# Altium schematic sheet pontH.SCHDOC
size A4
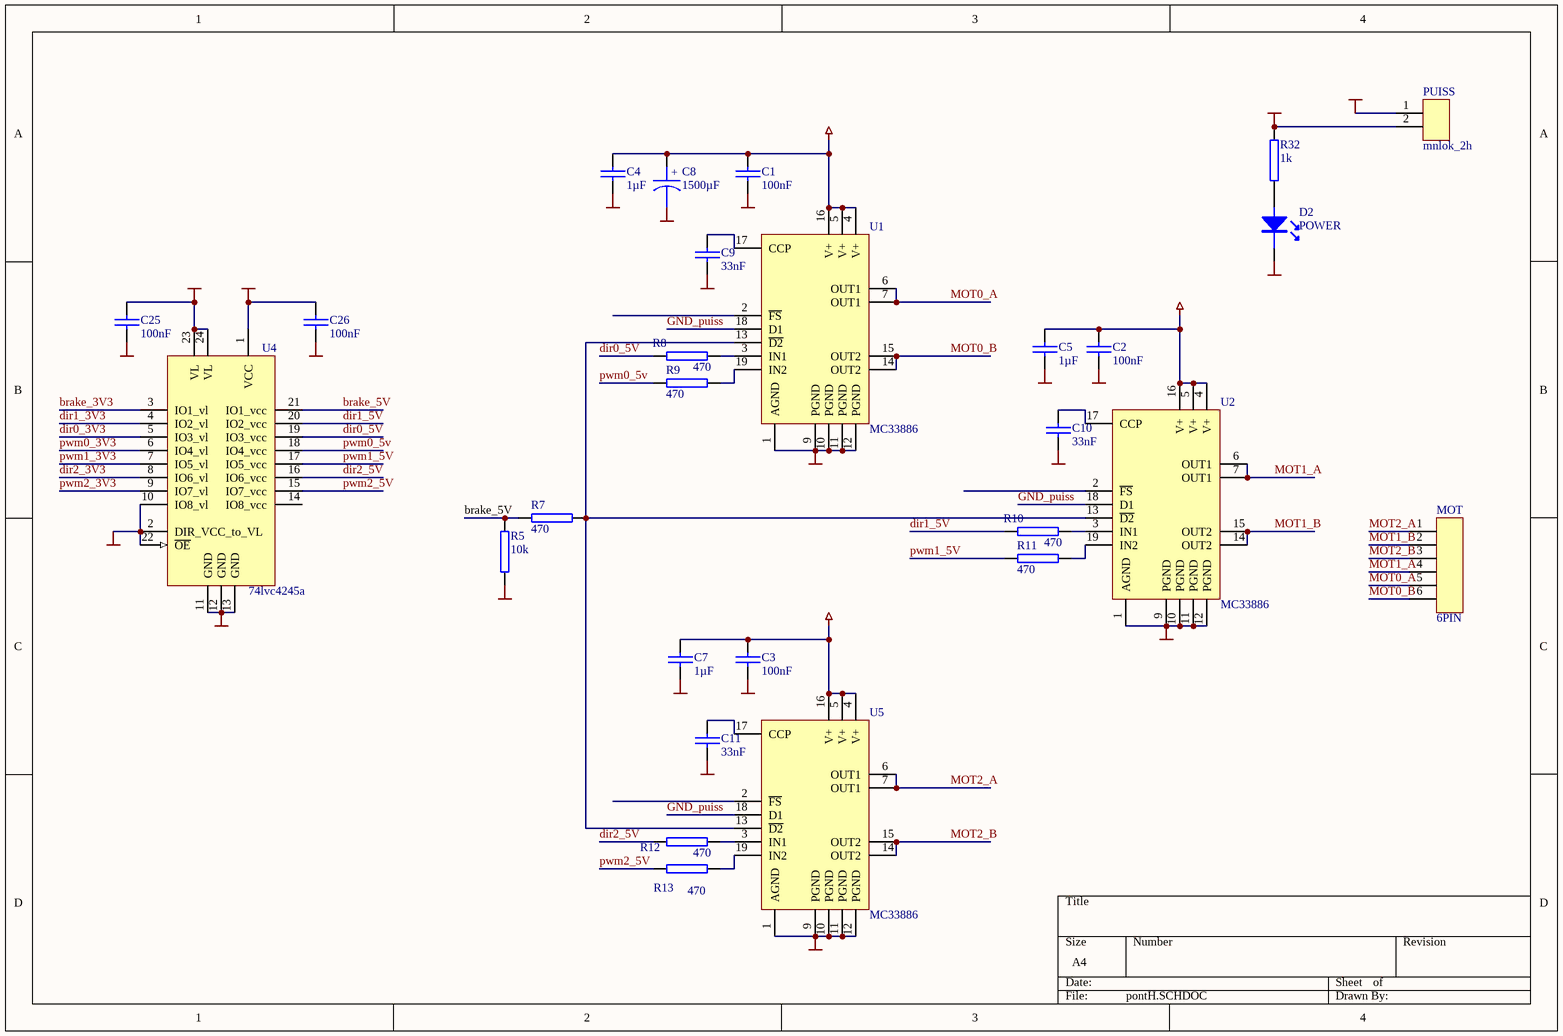
[diagram p0: pontH.SCHDOC]

## Parts
C1  100nF  [TCONDO]
C2  100nF  [TCONDO]
C3  100nF  [TCONDO]
C4  1µF  [TCONDO]
C5  1µF  [TCONDO]
C7  1µF  [TCONDO]
C8  1500µF  [CAPA_AXIAL_10_21]
C9  33nF  [0805]
C10  33nF  [0805]
C11  33nF  [0805]
C25  100nF  [0805]
C26  100nF  [TCONDO]
D2  POWER  [LED_CMS]
MOT  6PIN  [con_mat_n_lok_2*3H]
PUISS  mnlok_2h  [con_mat_n_lok_2h]
R5  10k  [0805]
R7  470  [TRES]
R8  470  [0805]
R9  470  [0805]
R10  470  [0805]
R11  470  [0805]
R12  470  [0805]
R13  470  [0805]
R32  1k  [0805]
U1  MC33886  [HSOP20]
U2  MC33886  [HSOP20]
U4  74lvc4245a  [SSOP24]
U5  MC33886  [HSOP20]

## Nets
3V3: C25.1 U4.23(VL) U4.24(VL)
5V: C26.1 U4.1(VCC)
+BATT: C1.1 C2.1 C3.1 C4.1 C5.1 C7.1 C8.1 PUISS.2 R32.2 U1.4(V+) U1.5(V+) U1.16(V+) U2.4(V+) U2.5(V+) U2.16(V+) U5.4(V+) U5.5(V+) U5.16(V+)
GND: C25.2 C26.2 R5.2 U4.2(DIR_VCC_to_VL) U4.10(IO8_vl) U4.11(GND) U4.12(GND) U4.13(GND) U4.22(~{OE})
GND_puiss: C1.2 C2.2 C3.2 C4.2 C5.2 C7.2 C8.2 C9.2 C10.2 C11.2 D2.2 PUISS.1 U1.1(AGND) U1.9(PGND) U1.10(PGND) U1.11(PGND) U1.12(PGND) U1.18(D1) U2.1(AGND) U2.9(PGND) U2.10(PGND) U2.11(PGND) U2.12(PGND) U2.18(D1) U5.1(AGND) U5.9(PGND) U5.10(PGND) U5.11(PGND) U5.12(PGND) U5.18(D1)
brake_3V3: U4.3(IO1_vl)
brake_5V: R5.1 R7.2 U4.21(IO1_vcc)
dir0_3V3: U4.5(IO3_vl)
dir0_5V: R8.1 U4.19(IO3_vcc)
dir1_3V3: U4.4(IO2_vl)
dir1_5V: R10.1 U4.20(IO2_vcc)
dir2_3V3: U4.8(IO6_vl)
dir2_5V: R12.1 U4.16(IO6_vcc)
MOT0_A: MOT.5 U1.6(OUT1) U1.7(OUT1)
MOT0_B: MOT.6 U1.14(OUT2) U1.15(OUT2)
MOT1_A: MOT.4 U2.6(OUT1) U2.7(OUT1)
MOT1_B: MOT.2 U2.14(OUT2) U2.15(OUT2)
MOT2_A: MOT.1 U5.6(OUT1) U5.7(OUT1)
MOT2_B: MOT.3 U5.14(OUT2) U5.15(OUT2)
pwm0_3V3: U4.6(IO4_vl)
pwm0_5v: R9.1 U4.18(IO4_vcc)
pwm1_3V3: U4.7(IO5_vl)
pwm1_5V: R11.1 U4.17(IO5_vcc)
pwm2_3V3: U4.9(IO7_vl)
pwm2_5V: R13.1 U4.15(IO7_vcc)
NetC9_1: C9.1 U1.17(CCP)
NetC10_1: C10.1 U2.17(CCP)
NetC11_1: C11.1 U5.17(CCP)
NetD2_1: D2.1 R32.1
NetR7_1: R7.1 U1.13(~{D2}) U2.13(~{D2}) U5.13(~{D2})
NetR8_2: R8.2 U1.3(IN1)
NetR9_2: R9.2 U1.19(IN2)
NetR10_2: R10.2 U2.3(IN1)
NetR11_2: R11.2 U2.19(IN2)
NetR12_2: R12.2 U5.3(IN1)
NetR13_2: R13.2 U5.19(IN2)

Not connected (* = marked no-connect by the designer): U1 2(~{FS}); U2 2(~{FS}); U4 14(IO8_vcc); U5 2(~{FS})

## Notes on the sheet
- (in symbol CAPACITOR POL) +

## Library data of the parts
C1-C3 C9-C11 = TCONDO
C4 C5 C7 C25 C26 = CONDO
C8 = CAPACITOR POL
D2 = LED_
PUISS = con_mat_n_lok_2h: connecteur mat'n-lok 2 voies horizontal
R5 R7-R13 = TRESIST
R32 = RES
U1 U2 U5 = MC33886: pont H 5A
U4 = 74ALVC4245: octal voltage transceiver